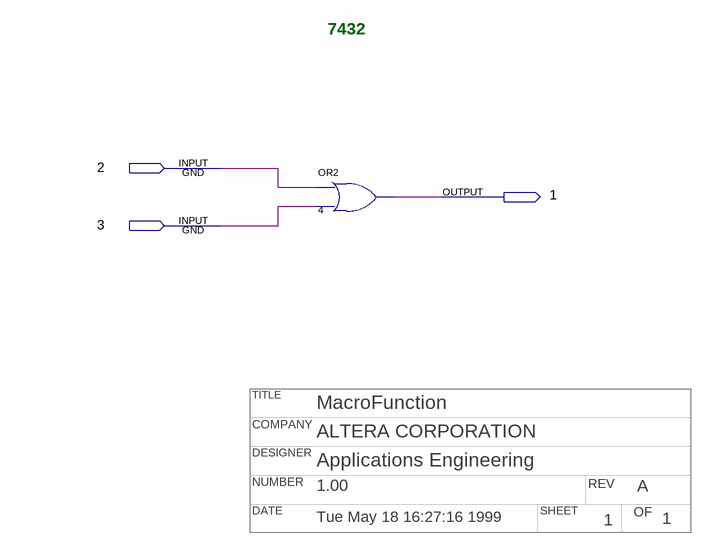
[diagram p0: schematic sheet]
// Quartus schematic 7432.bdf as structural Verilog: 1 symbols, 3 pins
// Title block: TITLE: MacroFunction; COMPANY: ALTERA CORPORATION; DESIGNER: Applications Engineering; NUMBER: 1.00; REV: A; DATE: Tue May 18 16:27:16 1999; SHEET: 1; OF: 1
module \7432  (
  input  \2 ,
  input  \3 ,
  output \1 
);

  or u_4 (\1 , \2 , \3 );

  // Notes on the sheet:
  //   7432
endmodule
